# EasyEDA schematic SCH_reciver.json
TITLE: Sheet_1; REV: 1.0; Date: 2024-06-21; Sheet: 1/1; Drawn By: liketoengineer; Company: Your Company
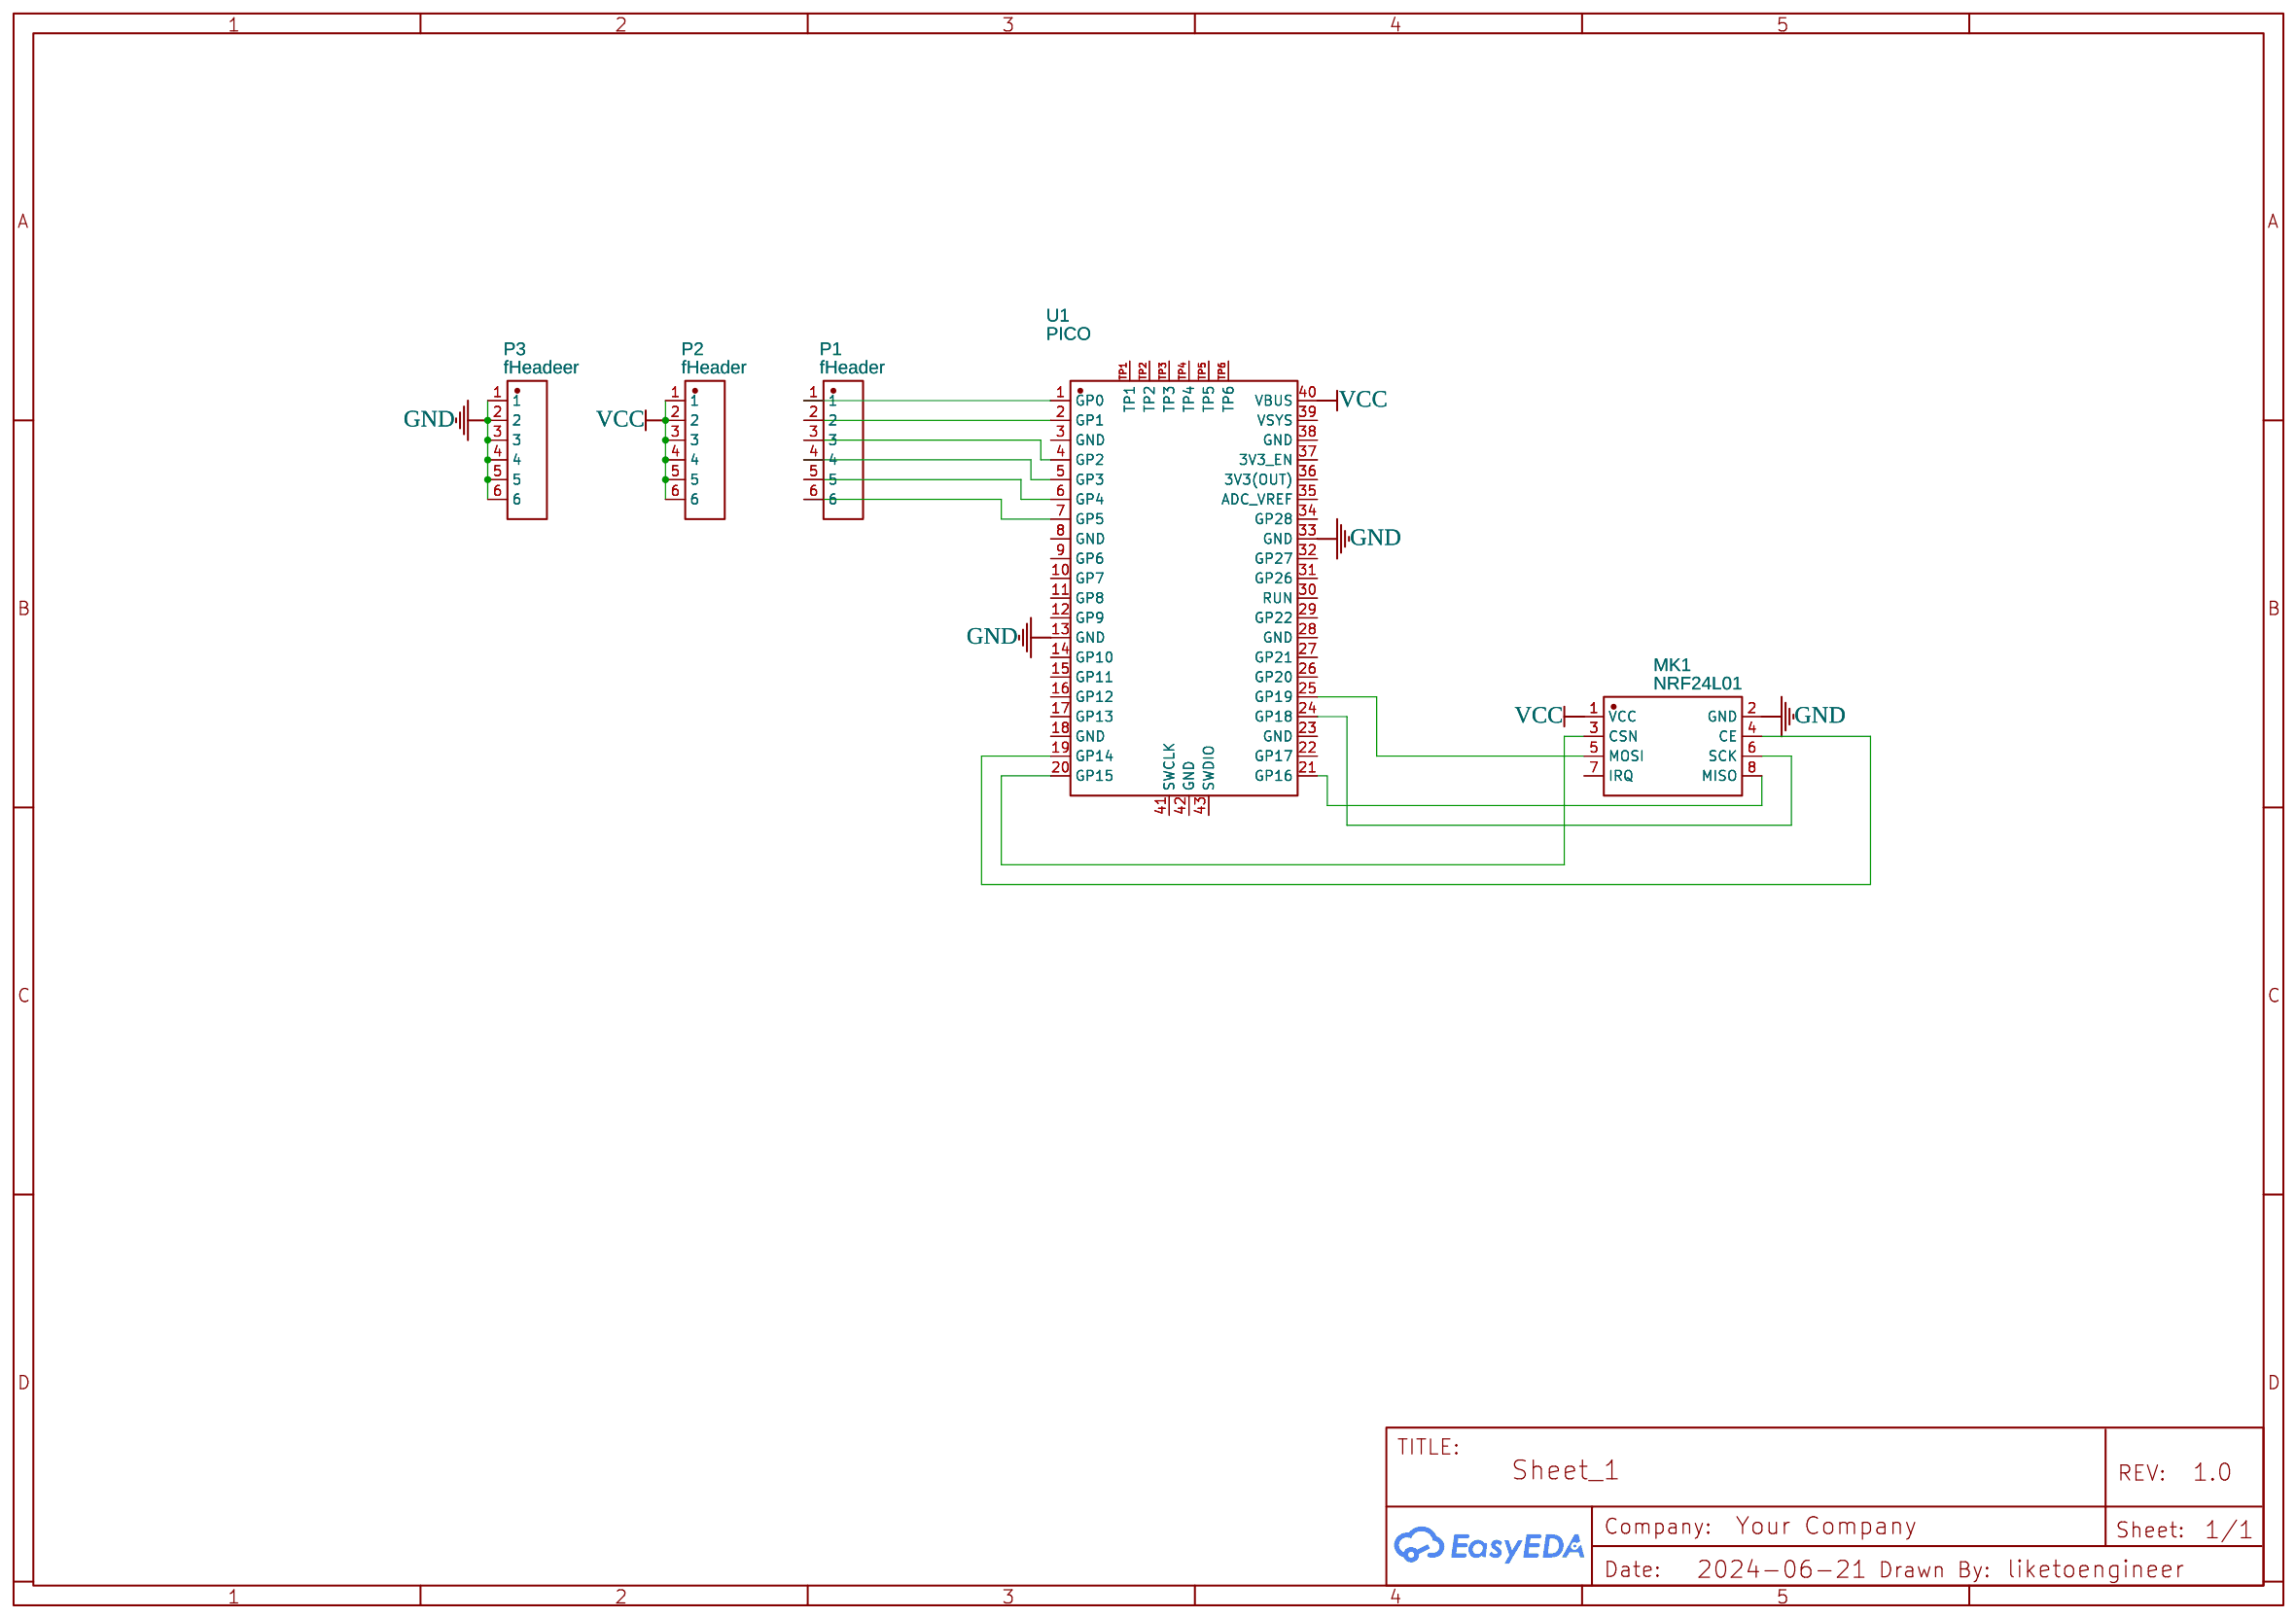
[diagram p0: schematic sheet]

## Parts
MK1  NRF24L01  [WIRELM-SMD_NRF24L01]
P1  fHeader  [HDR-TH_6P-P2.54-V-F]
P2  fHeader  [HDR-TH_6P-P2.54-V-F]
P3  fHeadeer  [HDR-TH_6P-P2.54-V-F]
U1  PICO  [COMM-SMD_L51.0-W21.0-P2.54_SC0916]

## Library data of the parts
MK1 = NRF24L01: Supplier: LCSC; Manufacturer: Ai-Thinker(安信可); Manufacturer Part: NF-04; Supplier Part: C90751; JLCPCB Part Class: Extended Part
P1-P3 = Header-Female-2.54_1x6: Supplier: LCSC; Manufacturer: BOOMELE(博穆精密); Manufacturer Part: 2.54-1*6P母; Supplier Part: C40877; JLCPCB Part Class: Extended Part
U1 = PICO: Supplier: LCSC; Supplier Part: C7203002; Manufacturer: Raspberry Pi(树莓派); JLCPCB Part Class: Extended Part; Contributor: lcsc

## Nets
GND: MK1.2(GND) P3.1 P3.2 P3.3 P3.4 P3.5 P3.6 U1.13(GND) U1.33(GND)
VCC: MK1.1(VCC) P2.1 P2.2 P2.3 P2.4 P2.5 P2.6 U1.40(VBUS)
Net-(MK1-3): MK1.3(CSN) U1.20(GP15)
Net-(MK1-4): MK1.4(CE) U1.19(GP14)
Net-(MK1-5): MK1.5(MOSI) U1.25(GP19)
Net-(MK1-6): MK1.6(SCK) U1.24(GP18)
Net-(MK1-8): MK1.8(MISO) U1.21(GP16)
Net-(P1-1): P1.1 U1.1(GP0)
Net-(P1-2): P1.2 U1.2(GP1)
Net-(P1-3): P1.3 U1.4(GP2)
Net-(P1-4): P1.4 U1.5(GP3)
Net-(P1-5): P1.5 U1.6(GP4)
Net-(P1-6): P1.6 U1.7(GP5)

Not connected (* = marked no-connect by the designer): MK1 7(IRQ); U1 3(GND) 8(GND) 9(GP6) 10(GP7) 11(GP8) 12(GP9) 14(GP10) 15(GP11) 16(GP12) 17(GP13) 18(GND) 22(GP17) 23(GND) 26(GP20) 27(GP21) 28(GND) 29(GP22) 30(RUN) 31(GP26) 32(GP27) 34(GP28) 35(ADC_VREF) 36(3V3(OUT)) 37(3V3_EN) 38(GND) 39(VSYS) 41(SWCLK) 42(GND) 43(SWDIO) TP1 TP2 TP3 TP4 TP5 TP6
